# Altium project 15V.PrjPcb
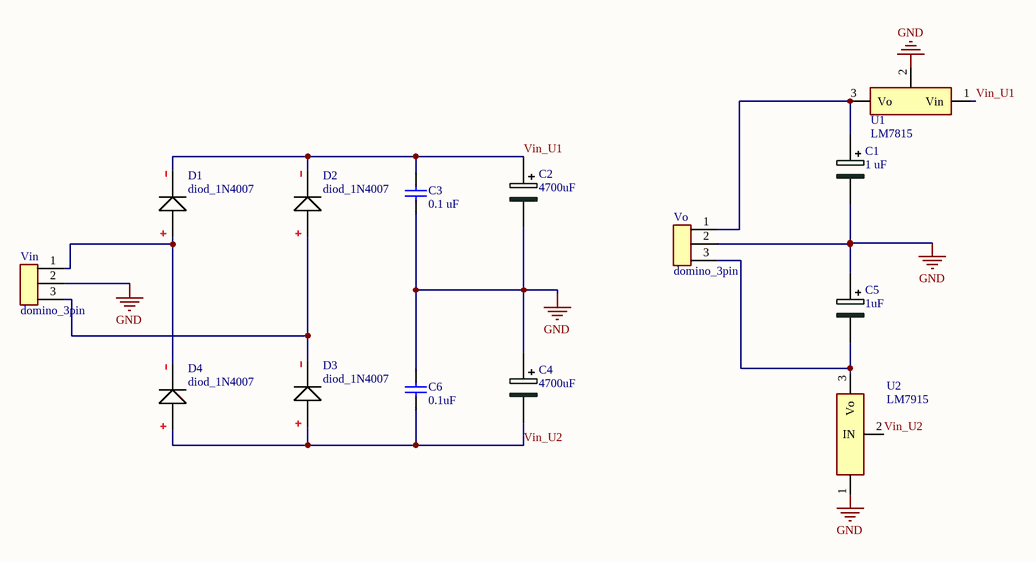
[diagram p0: Sheet1.SchDoc]
2 sheets, 28 parts. Net scope: global (net labels, ports and power ports of the same name join across sheets).
Board files: PCB1.PcbDoc, PCB1 (1).PcbDoc
Sheets:
  Sheet1.SchDoc
  Sheet1 (1).SchDoc

## Sheet Sheet1.SchDoc
size A4; SheetNumber: 1; SheetTotal: 1

### Parts
(Parts that share a designator on the sheet are numbered #1, #2 ... from top to bottom, then left to right.)
C1#1  1 uF  [capacitor_elec_t/h_5mm]
C2#1  4700uF  [capacitor_elec_t/h_5mm]
C3#1  0.1 uF  [tu gom]
C4#1  4700uF  [capacitor_elec_t/h_5mm]
C5#1  1uF  [capacitor_elec_t/h_5mm]
C6#1  0.1uF  [tu gom]
D1#1  diod_1N4007  [diode_t/h_1N4007]
D2#1  diod_1N4007  [diode_t/h_1N4007]
D3#1  diod_1N4007  [diode_t/h_1N4007]
D4#1  diod_1N4007  [diode_t/h_1N4007]
U1#1  LM7815  [LM7812]
U2#1  LM7915  [LM7915]
Vin  domino_3pin  [domino_3pin_5.08mm]
Vo  domino_3pin  [domino_3pin_5.08mm]

### Nets
GND: C1#1.2 C2#1.2 C3#1.2 C4#1.1 C5#1.1 C6#1.2 U1#1.2(GND) U2#1.1(GND) Vin.2 Vo.2
Vin_U1: C2#1.1 C3#1.1 D1#1.2(K) D2#1.2(K) U1#1.1(Vin)
Vin_U2: C4#1.2 C6#1.1 D3#1.1(A) D4#1.1(A) U2#1.2(IN)
NetC1#1_1: C1#1.1 U1#1.3(Vo) Vo.1
NetC5#1_2: C5#1.2 U2#1.3(Vo) Vo.3
NetD1#1_1: D1#1.1(A) D4#1.2(K) Vin.1
NetD2#1_1: D2#1.1(A) D3#1.2(K) Vin.3

### Library data of the parts
C1#1 C2#1 C4#1 C5#1 = capacitor_electric
C3#1 C6#1 = Tu gom 223 50V: Cắm; Don_Vi: Con; So_Chan: 2; Ten_Linh_Kien: Tụ gốm 223-22nF 50V; Ma_Hang: MH007018; Chung_Loai: Cắm; Kieu_Chan: *
U1#1 = LM7812

## Sheet Sheet1 (1).SchDoc
size A4; SheetNumber: 2; SheetTotal: 2
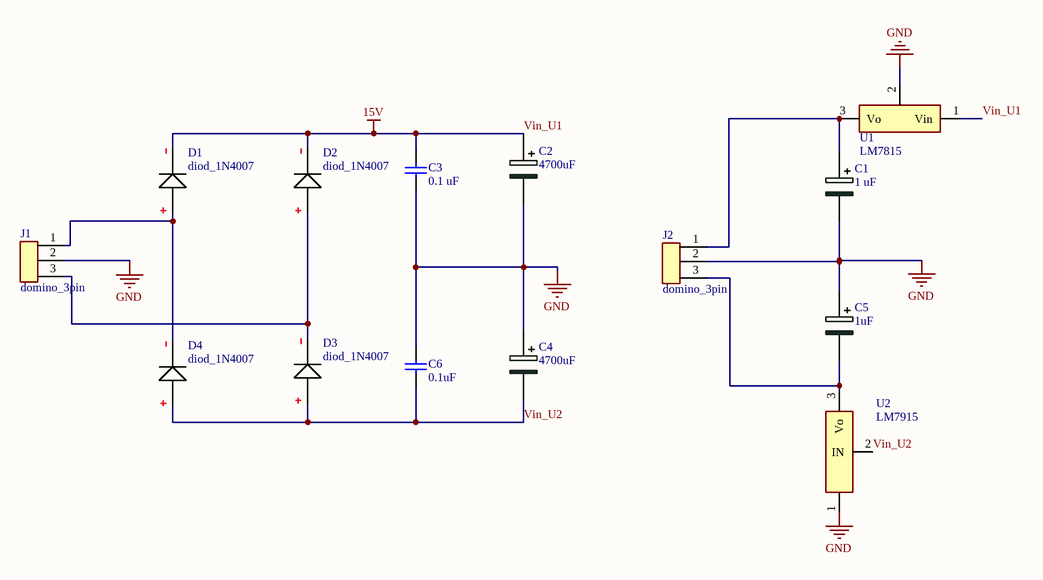
[diagram p1: Sheet1 (1).SchDoc]

### Parts
(Parts that share a designator on the sheet are numbered #1, #2 ... from top to bottom, then left to right.)
C1#2  1 uF  [capacitor_elec_t/h_5mm]
C2#2  4700uF  [capacitor_elec_t/h_5mm]
C3#2  0.1 uF  [tu gom]
C4#2  4700uF  [capacitor_elec_t/h_5mm]
C5#2  1uF  [capacitor_elec_t/h_5mm]
C6#2  0.1uF  [tu gom]
D1#2  diod_1N4007  [diode_t/h_1N4007]
D2#2  diod_1N4007  [diode_t/h_1N4007]
D3#2  diod_1N4007  [diode_t/h_1N4007]
D4#2  diod_1N4007  [diode_t/h_1N4007]
J1  domino_3pin  [domino_3pin_5.08mm]
J2  domino_3pin  [domino_3pin_5.08mm]
U1#2  LM7815  [LM7812]
U2#2  LM7915  [LM7915]

### Nets
GND: C1#2.2 C2#2.2 C3#2.2 C4#2.1 C5#2.1 C6#2.2 J1.2 J2.2 U1#2.2(GND) U2#2.1(GND)
Vin_U1: C2#2.1 C3#2.1 D1#2.2(K) D2#2.2(K) U1#2.1(Vin)  [also labelled 15V]
Vin_U2: C4#2.2 C6#2.1 D3#2.1(A) D4#2.1(A) U2#2.2(IN)
NetC1#2_1: C1#2.1 J2.1 U1#2.3(Vo)
NetC5#2_2: C5#2.2 J2.3 U2#2.3(Vo)
NetD1#2_1: D1#2.1(A) D4#2.2(K) J1.1
NetD2#2_1: D2#2.1(A) D3#2.2(K) J1.3

### Library data of the parts
C1#2 C2#2 C4#2 C5#2 = capacitor_electric
C3#2 C6#2 = Tu gom 223 50V: as C3#1 on sheet Sheet1; Chung_Loai: Cắm; Kieu_Chan: *
U1#2 = LM7812

## Nets that join several sheets
GND: Sheet1 (10 pins), Sheet1 (1) (10 pins)
Vin_U1: Sheet1 (5 pins), Sheet1 (1) (5 pins)
Vin_U2: Sheet1 (5 pins), Sheet1 (1) (5 pins)